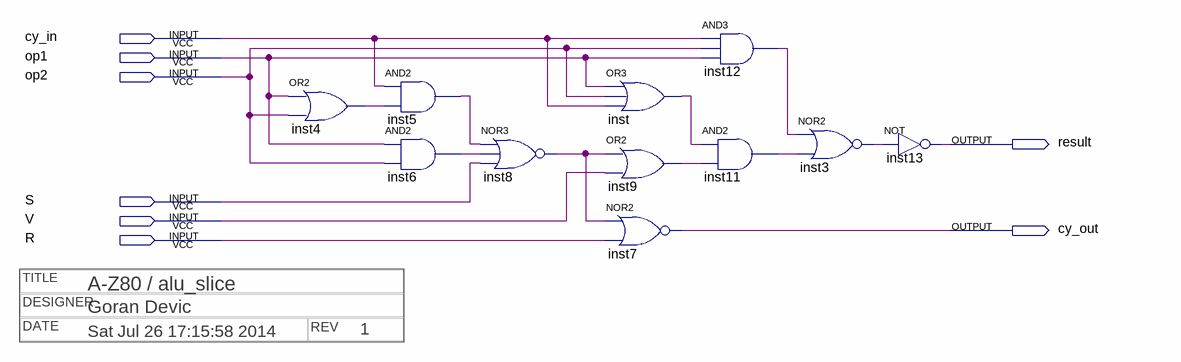
[diagram p0: schematic sheet]
// Quartus schematic alu_slice.bdf as structural Verilog: 11 symbols, 8 pins
// Title block: DATE: Sat Jul 26 17:15:58 2014; DESIGNER: Goran Devic; REV: 1; TITLE: A-Z80 / alu_slice
module alu_slice (
  input  cy_in,
  input  op1,
  input  op2,
  input  S,
  input  V,
  input  R,
  output result,
  output cy_out
);

  wire inst3_out, inst4_out, inst5_out, inst6_out, inst8_out, inst9_out, inst11_out, inst12_out, inst_out;

  or inst4 (inst4_out, op1, op2);
  and inst5 (inst5_out, cy_in, inst4_out);
  and inst6 (inst6_out, op1, op2);
  nor inst8 (inst8_out, inst5_out, inst6_out, S);
  or inst (inst_out, op1, op2, cy_in);
  or inst9 (inst9_out, inst8_out, V);
  nor inst7 (cy_out, inst8_out, R);
  and inst12 (inst12_out, cy_in, op2, op1);
  and inst11 (inst11_out, inst_out, inst9_out);
  nor inst3 (inst3_out, inst12_out, inst11_out);
  not inst13 (result, inst3_out);
endmodule
